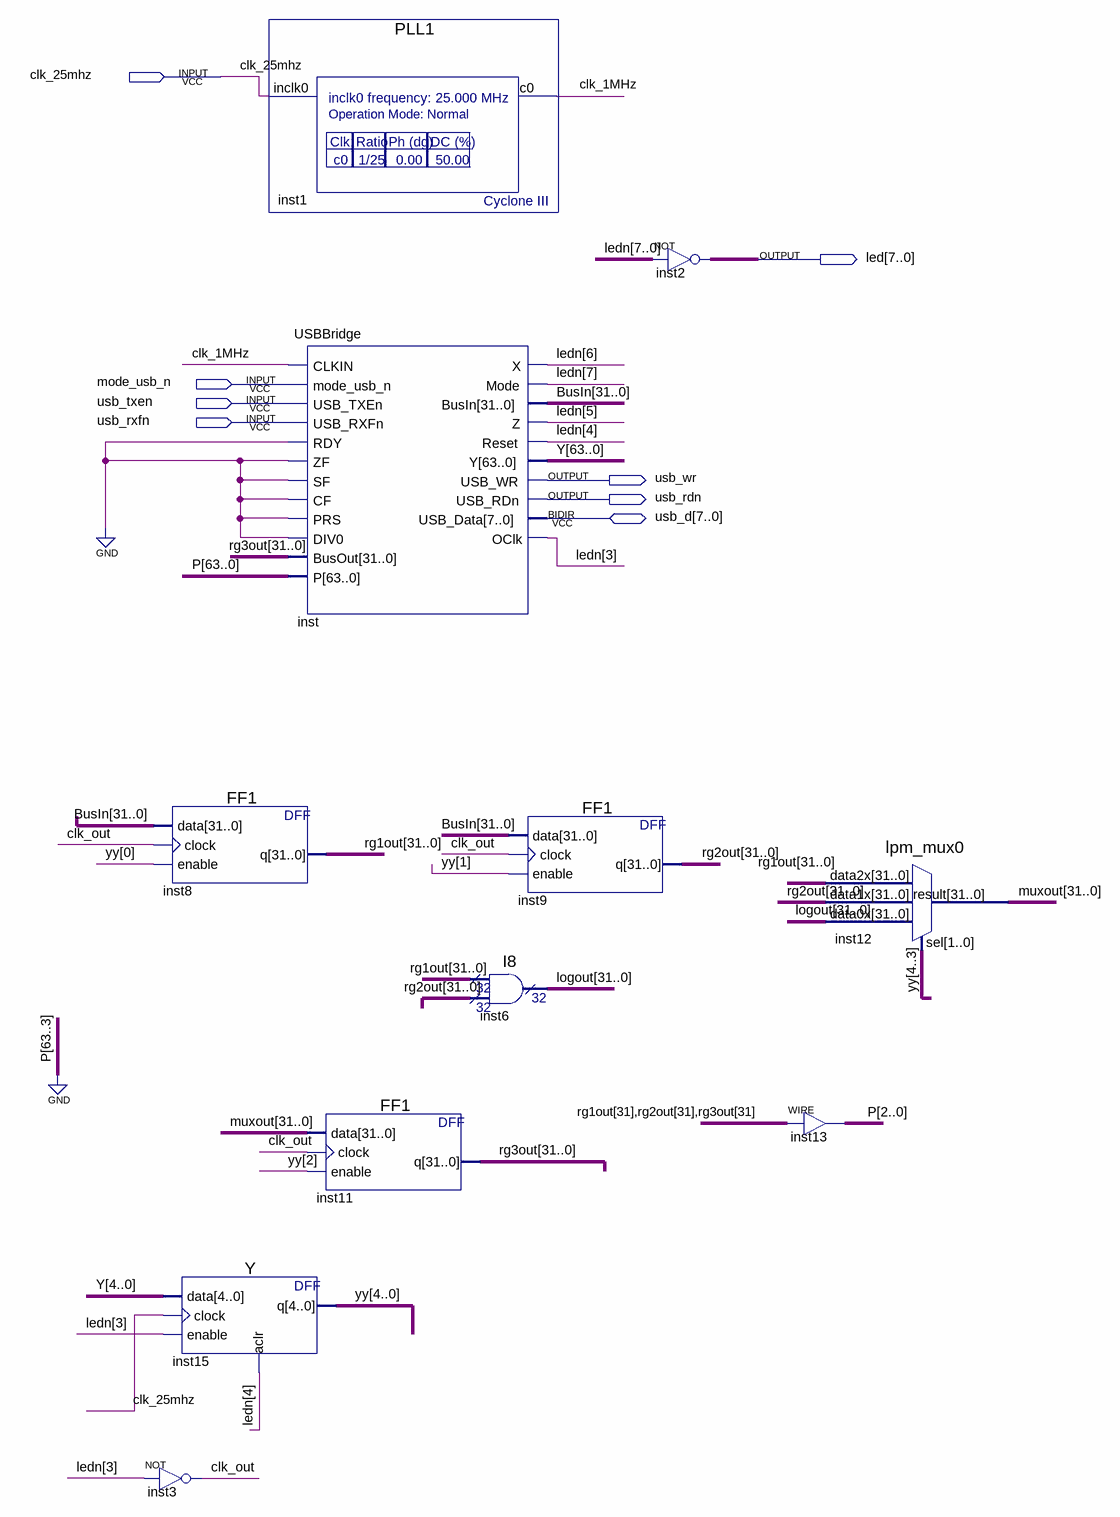
[diagram p0: schematic sheet]
// Quartus schematic project.bdf as structural Verilog: 11 symbols, 8 pins
module project (
  input  clk_25mhz,
  input  mode_usb_n,
  input  usb_txen,
  input  usb_rxfn,
  inout  [7:0] usb_d,
  output [7:0] led,
  output usb_wr,
  output usb_rdn
);

  wire clk_1MHz, clk_out;
  wire [2:0] P;
  wire [4:0] yy;
  wire [7:0] ledn;
  wire [31:0] BusIn, logout, muxout, rg1out, rg2out, rg3out;
  wire [63:0] Y;

  FF1 inst8 (.data(BusIn), .clock(clk_out), .enable(yy[0]), .q(rg1out));
  Y inst15 (.data(Y[4:0]), .clock(clk_25mhz), .enable(ledn[3]), .aclr(ledn[4]), .q(yy));
  not inst3 (clk_out, ledn[3]);
  PLL1 inst1 (.inclk0(clk_25mhz), .c0(clk_1MHz));
  USBBridge inst (
    .CLKIN(clk_1MHz), .mode_usb_n(mode_usb_n), .USB_TXEn(usb_txen), .USB_RXFn(usb_rxfn), .RDY(1'b0),
    .ZF(1'b0), .SF(1'b0), .CF(1'b0), .PRS(1'b0), .DIV0(1'b0), .BusOut(rg3out), .P({{61{1'b0}}, P}),
    .X(ledn[6]), .Mode(ledn[7]), .BusIn(BusIn), .Z(ledn[5]), .Reset(ledn[4]), .Y(Y), .USB_WR(usb_wr),
    .USB_RDn(usb_rdn), .OClk(ledn[3]), .USB_Data(usb_d));
  FF1 inst11 (.data(muxout), .clock(clk_out), .enable(yy[2]), .q(rg3out));
  FF1 inst9 (.data(BusIn), .clock(clk_out), .enable(yy[1]), .q(rg2out));
  I8 inst6 (.data0x(rg1out), .data1x(rg2out), .result(logout));
  assign led = ~ledn;  // NOT inst2, 8 bits wide
  lpm_mux0 inst12 (.data2x(rg1out), .data1x(rg2out), .data0x(logout), .sel(yy[4:3]), .result(muxout));
  assign P = {rg1out[31], rg2out[31], rg3out[31]};  // WIRE inst13
endmodule
